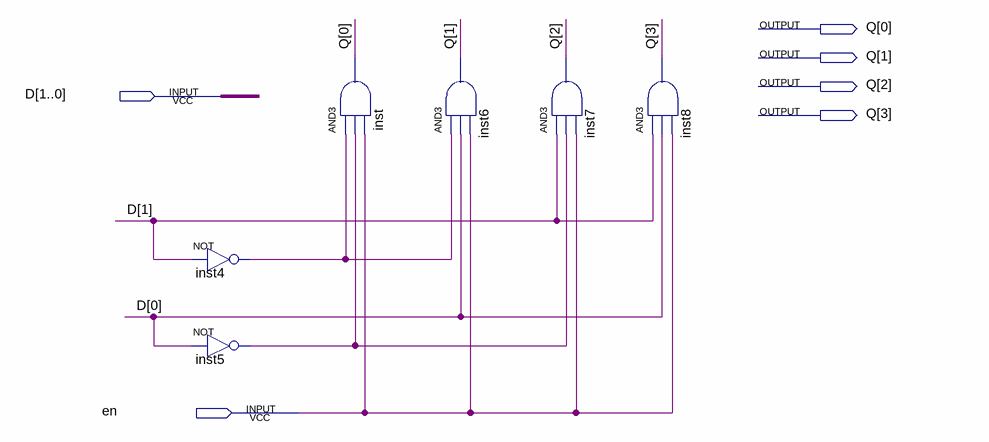
[diagram p0: schematic sheet]
// Quartus schematic dec2_4.bdf as structural Verilog: 6 symbols, 6 pins
module dec2_4 (
  input  [1:0] D,
  input  en,
  output [3:0] Q
);

  wire inst4_out, inst5_out;

  not inst4 (inst4_out, D[1]);
  not inst5 (inst5_out, D[0]);
  and inst (Q[0], inst4_out, inst5_out, en);
  and inst6 (Q[1], inst4_out, D[0], en);
  and inst7 (Q[2], D[1], inst5_out, en);
  and inst8 (Q[3], D[1], D[0], en);
endmodule
